# Altium schematic sheet Ethernet.SchDoc: Ethernet PHY with RJ45 connector
size A4; Date: 25-FEB-2015; Author: A.B; CompanyName: STMicroelectronics; Address1: 12, Rue Jules HOROWITZ; Address2: 38019 Grenoble; Address3: FRANCE; DocumentNumber: MB1191; Revision: B-02; SheetNumber: 11; SheetTotal: 13; Project: STM32F746G-DISCO
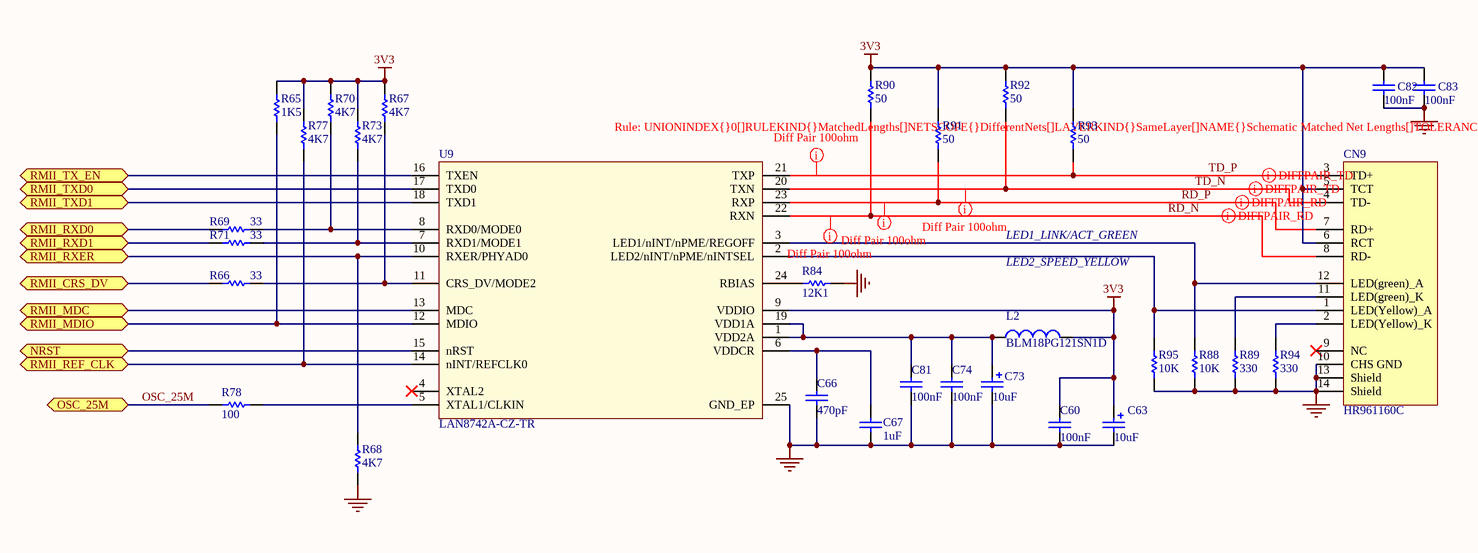
[diagram p0: Ethernet.SchDoc]

## Parts
C60  100nF  [0402C]
C63  10uF  [TAN-A]
C66  470pF  [0402C]
C67  1uF  [0603C]
C73  10uF  [TAN-A]
C74  100nF  [0402C]
C81  100nF  [0402C]
C82  100nF  [0402C]
C83  100nF  [0402C]
CN9  HR961160C  [RJ45_HR961160C]
L2  BLM18PG121SN1D  [0603L]
R65  1K5  [0402R]
R66  33  [0402R]
R67  4K7  [0402R]
R68  4K7  [0402R]
R69  33  [0402R]
R70  4K7  [0402R]
R71  33  [0402R]
R73  4K7  [0402R]
R77  4K7  [0402R]
R78  100  [0402R]
R84  12K1  [0603R]
R88  10K  [0402R]
R89  330  [0402R]
R90  50  [0402R]
R91  50  [0402R]
R92  50  [0402R]
R93  50  [0402R]
R94  330  [0402R]
R95  10K  [0402R]
U9  LAN8742A-CZ-TR  [QFN24_0R5_4X4]

## Ports
NRST, OSC_25M, RMII_CRS_DV, RMII_MDC, RMII_MDIO, RMII_REF_CLK, RMII_RXD0, RMII_RXD1, RMII_RXER, RMII_TX_EN, RMII_TXD0, RMII_TXD1

## Nets
3V3: C60.2 C63.1 C82.2 C83.2 CN9.5(TCT) CN9.6(RCT) L2.2 R65.2 R67.2 R70.2 R73.2 R77.2 R90.1 R91.1 R92.1 R93.1 U9.9(VDDIO)
GND: C60.1 C63.2 C66.1 C67.1 C73.2 C74.1 C81.1 C82.1 C83.1 CN9.10(CHS_GND) CN9.13(Shield) CN9.14(Shield) R68.1 R84.2 R88.1 R89.1 R94.1 R95.1 U9.25(GND_EP)
NRST: U9.15(nRST) ; port NRST
OSC_25M: R78.1 ; port OSC_25M
RD_N: CN9.8(RD-) R90.2 U9.22(RXN)
RD_P: CN9.7(RD+) R91.2 U9.23(RXP)
RMII_CRS_DV: R66.2 ; port RMII_CRS_DV
RMII_MDC: U9.13(MDC) ; port RMII_MDC
RMII_MDIO: R65.1 U9.12(MDIO) ; port RMII_MDIO
RMII_REF_CLK: R77.1 U9.14(nINT/REFCLK0) ; port RMII_REF_CLK
RMII_RXD0: R69.2 ; port RMII_RXD0
RMII_RXD1: R71.2 ; port RMII_RXD1
RMII_RXER: R68.2 U9.10(RXER/PHYAD0) ; port RMII_RXER
RMII_TX_EN: U9.16(TXEN) ; port RMII_TX_EN
RMII_TXD0: U9.17(TXD0) ; port RMII_TXD0
RMII_TXD1: U9.18(TXD1) ; port RMII_TXD1
TD_N: CN9.4(TD-) R92.2 U9.20(TXN)
TD_P: CN9.3(TD+) R93.2 U9.21(TXP)
NetC66_2: C66.2 C67.2 U9.6(VDDCR)
NetC73_1: C73.1 C74.2 C81.2 L2.1 U9.1(VDD2A) U9.19(VDD1A)
NetCN9_1: CN9.1(LED(Yellow)_A) R95.2 U9.2(LED2/nINT/nPME/nINTSEL)
NetCN9_2: CN9.2(LED(Yellow)_K) R94.2
NetCN9_11: CN9.11(LED(green)_K) R89.2
NetCN9_12: CN9.12(LED(green)_A) R88.2 U9.3(LED1/nINT/nPME/REGOFF)
NetR66_1: R66.1 R67.1 U9.11(CRS_DV/MODE2)
NetR69_1: R69.1 R70.1 U9.8(RXD0/MODE0)
NetR71_1: R71.1 R73.1 U9.7(RXD1/MODE1)
NetR78_2: R78.2 U9.5(XTAL1/CLKIN)
NetR84_1: R84.1 U9.24(RBIAS)

Not connected (* = marked no-connect by the designer): CN9 9(NC)*; U9 4(XTAL2)*

## Layout directives
differential pair: RD_N, RD_P, TD_N, TD_P
rule Matched Net Lengths [Tolerance = 100mil]: RD_N, RD_P, TD_N, TD_P

## Notes on the sheet
- LED2_SPEED_YELLOW
- LED1_LINK/ACT_GREEN
- Title:
- Project:
- Size:
- Date:
- A4
- Reference:
- Sheet:
- Revision:
- of

## Library data of the parts
C60 C74 C81-C83 = Cap_100nF_X7R_10%_0402: Capacitor,100nF,16V,X7R,10%,0402,YAGEO; Manuf_Part_1: CC0402KRX7R7BB104; Revision: July-2002: Re-released for DXP Platform.; Value: 100nF; Order: CC0402KRX7R7BB104; Manuf_1: YAGEO
C63 C73 = Cap_10uF_POL_10%_TANA: Polarized Capacitor,10uF,10V,10%,typeA,VISHAY; Manuf_Part_1: 293D106X9010A2TE3; Revision: July-2002: Re-released for DXP Platform.; Value: 10uF; Manuf_1: VISHAY; Order: *; ECCN_US/EU: n/a
C66 = Cap_470pF_X7R_10%_0402: Capacitor,470pF,16V,X7R,10%,0402,YAGEO; Manuf_Part_1: 0402YC471KAT4A; Revision: July-2002: Re-released for DXP Platform.; Value: 470pF; Order: 0402YC471KAT4A; Manuf_1: YAGEO; ECCN_US/EU: n/a
C67 = Cap_1uF_X5R_10%_0603: Capacitor,1uF,16V,X5R,10%,0603,YAGEO; Manuf_Part_1: CC0603KRX5R7BB105; Revision: July-2002: Re-released for DXP Platform.; Value: 1uF; Order: CC0603KRX5R7BB105; Manuf_1: YAGEO; ECCN_US/EU: n/a
CN9 = HR961160C: 100 Base-TX (Fast Ethernet) SMD RJ45 single port (1x1) with LEDS Integrated Magnetics Connector; Manuf_1: HanRun; Manuf_2: Pulse Electronics Corporation; Manuf_Part_2: J3011G21DNLT; Manuf_3: K.O.D International Holding; Manuf_Part_3: RMT-119A-12F6-GY-04; Distrib: Sub Co; Manuf_Part_1: HR961160C; Order: *
L2 = BEAD_120R_2A_0603: Bead,120R,2A,0603,BLM18PG121SN1D,MURATA; Manuf_Part_3: FCM1608KF-601T03; Manuf_2: TDK; Manuf_Part_2: MPZ1608S300A; Manuf_3: Tai-tech; Value: 100uH; Description_3: Bead,600R,350mA,0603,FCM1608KF-601T03,Tai-tech; Description_2: Bead,30R,5A,0603,MPZ1608S300A,TDK; Revision: July-2002: Re-released for DXP Platform.; ECCN_US/EU: n/a; Manuf_Part_1: BLM18PG121SN1D; Manuf_1: MURATA
R65 = Res_1K5_1%_0402: Resistor,1K5,0402,1%,YAGEO; Manuf_Part_1: RC0402FR-071K5L; Value: 1K5; Manuf_1: YAGEO; Order: RC0402FR-071K5L; ECCN_US/EU: n/a; Distrib: FARNELL
R66 R69 R71 = Res_33_1%_0402: Resistor,33,0402,1%,YAGEO; Manuf_Part_1: RC0402FR-0733RL; Value: 33; Manuf_1: YAGEO; Order: *; ECCN_US/EU: n/a; Distrib: FARNELL
R67 R68 R70 R73 R77 = Res_4K7_1%_0402: Resistor,4K7,0402,1%,YAGEO; Manuf_Part_1: RT0402FRE074K7L; Value: 4K7; Manuf_1: YAGEO; Order: RT0402FRE074K7L; ECCN_US/EU: n/a
R78 = Res_100_1%_0402: Resistor,100,0402,1%,YAGEO; Manuf_Part_1: RC0402FR-07100RL; Order: 9239111; Value: 100; Manuf_1: YAGEO; ECCN_US/EU: n/a; Distrib: FARNELL
R84 = Res_12K1_1%_0603: Resistor,12K1,0603,1%,VISHAY; Manuf_Part_1: MCT 0603-50 1% P5 12K1; Order: 2325243; Value: 12K1; ECCN_US/EU: n/a; Manuf_1: VISHAY; Distrib: FARNELL
R88 R95 = Res_10K_1%_0402: Resistor,10K,0402,1%,YAGEO; Manuf_Part_1: RC0402FR-0710KL; Value: 10K; Manuf_1: YAGEO; Order: RC0402FR-0710KL; ECCN_US/EU: n/a
R89 R94 = Res_330_1%_0402: Resistor,330,0402,1%,YAGEO; Manuf_Part_1: RC0402FR-07330RL; Value: 330; ECCN_US/EU: n/a; Manuf_1: YAGEO; Distrib: DIGIKEY; Order: RC0402FR-07330RL
R90-R93 = Res_50_1%_0402: Resistor,50,0402,1%,YAGEO; Manuf_Part_1: RC0402FR-0750RL; Value: 50; Manuf_1: YAGEO; Order: *; ECCN_US/EU: n/a; Distrib: FARNELL
U9 = LAN8742A-CZ-TR: LAN8742A-CZ-TR - Small Footprint RMII 10/100 Ethernet, Transceiver with HP Auto-MDIX and flexPWR Technology SQFN-24; Manuf_1: MICROCHIP; Order: LAN8742A-CZ-TR; Manuf_Part_1: LAN8742A-CZ-TR; Distrib: MICROCHIP